# Altium schematic sheet MMU_LSM6D.SchDoc: MMU_LSD6D
size A4; DrawnBy: BossFish; Revision: Test/v0.2; SheetNumber: 4; SheetTotal: 4
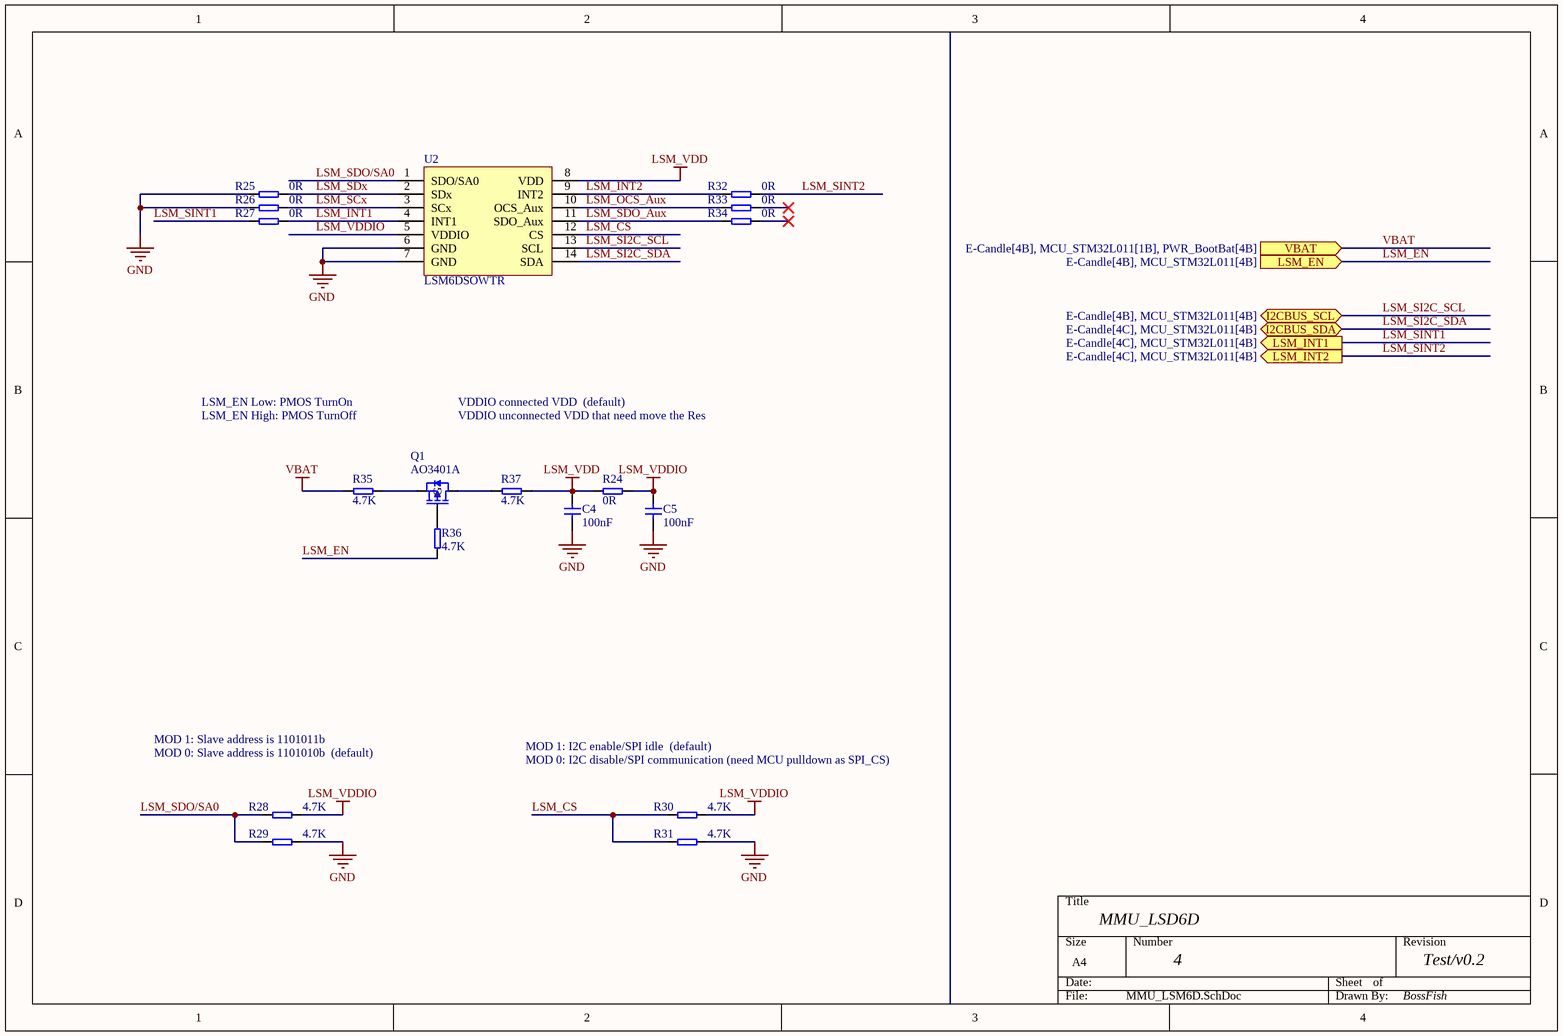
[diagram p0: MMU_LSM6D.SchDoc]

## Parts
C4  100nF  [0603-C]
C5  100nF  [0603-C]
Q1  AO3401A  [SOT-23-3]
R24  0R  [0603-R]
R25  0R  [0603-R]
R26  0R  [0603-R]
R27  0R  [0603-R]
R28  4.7K  [0603-R]
R29  4.7K  [0603-R]
R30  4.7K  [0603-R]
R31  4.7K  [0603-R]
R32  0R  [0603-R]
R33  0R  [0603-R]
R34  0R  [0603-R]
R35  4.7K  [0603-R]
R36  4.7K  [0603-R]
R37  4.7K  [0603-R]
U2  LSM6DSOWTR  [LGA-14L(2.5x3.0)]

## Ports
I2CBUS_SCL (bidir, see E-Candle[4B], MCU_STM32L011[4B]), I2CBUS_SDA (bidir, see E-Candle[4C], MCU_STM32L011[4B]), LSM_EN (in, see E-Candle[4B], MCU_STM32L011[4B]), LSM_INT1 (out, see E-Candle[4C], MCU_STM32L011[4B]), LSM_INT2 (out, see E-Candle[4C], MCU_STM32L011[4B]), VBAT (in, see E-Candle[4B], MCU_STM32L011[1B], PWR_BootBat[4B])

## Nets
GND: C4.1 C5.1 R25.1 R26.1 R29.2 R31.2 U2.6(GND) U2.7(GND)
LSM_VDD: C4.2 R24.1 R37.1 U2.8(VDD)
LSM_VDDIO: C5.2 R24.2 R28.2 R30.2 U2.5(VDDIO)
VBAT: R35.2 ; port VBAT
LSM_CS: R30.1 R31.1 U2.12(CS)
LSM_EN: R36.2 ; port LSM_EN
LSM_INT1: R27.2 U2.4(INT1)
LSM_INT2: R32.1 U2.9(INT2)
LSM_OCS_Aux: R33.1 U2.10(OCS_Aux)
LSM_SCx: R26.2 U2.3(SCx)
LSM_SDO/SA0: R28.1 R29.1 U2.1(SDO/SA0)
LSM_SDO_Aux: R34.1 U2.11(SDO_Aux)
LSM_SDx: R25.2 U2.2(SDx)
LSM_SI2C_SCL: U2.13(SCL) ; port I2CBUS_SCL
LSM_SI2C_SDA: U2.14(SDA) ; port I2CBUS_SDA
LSM_SINT1: R27.1 ; port LSM_INT1
LSM_SINT2: R32.2 ; port LSM_INT2
NetQ1_1: Q1.1(D) R37.2
NetQ1_2: Q1.2(G) R36.1
NetQ1_3: Q1.3(S) R35.1

Not connected (* = marked no-connect by the designer): R33 2*; R34 2*

## Notes on the sheet
- LSM_EN Low: PMOS TurnOn
- LSM_EN High: PMOS TurnOff
- VDDIO connected VDD  (default)
- VDDIO unconnected VDD that need move the Res
- MOD 1: Slave address is 1101011b
- MOD 0: Slave address is 1101010b  (default)
- MOD 1: I2C enable/SPI idle  (default)
- MOD 0: I2C disable/SPI communication (need MCU pulldown as SPI_CS)

## Library data of the parts
C4 C5 = Cap
Q1 = MOSFET-P
R24-R37 = Res
U2 = LSM6DSOWTR: 6-axis IMU (inertial measurement unit): / always-on 3‑axis accelerometer and 3‑axis gyroscop